# EAGLE design PIC18F26J50 (EAGLE 6.5.0)
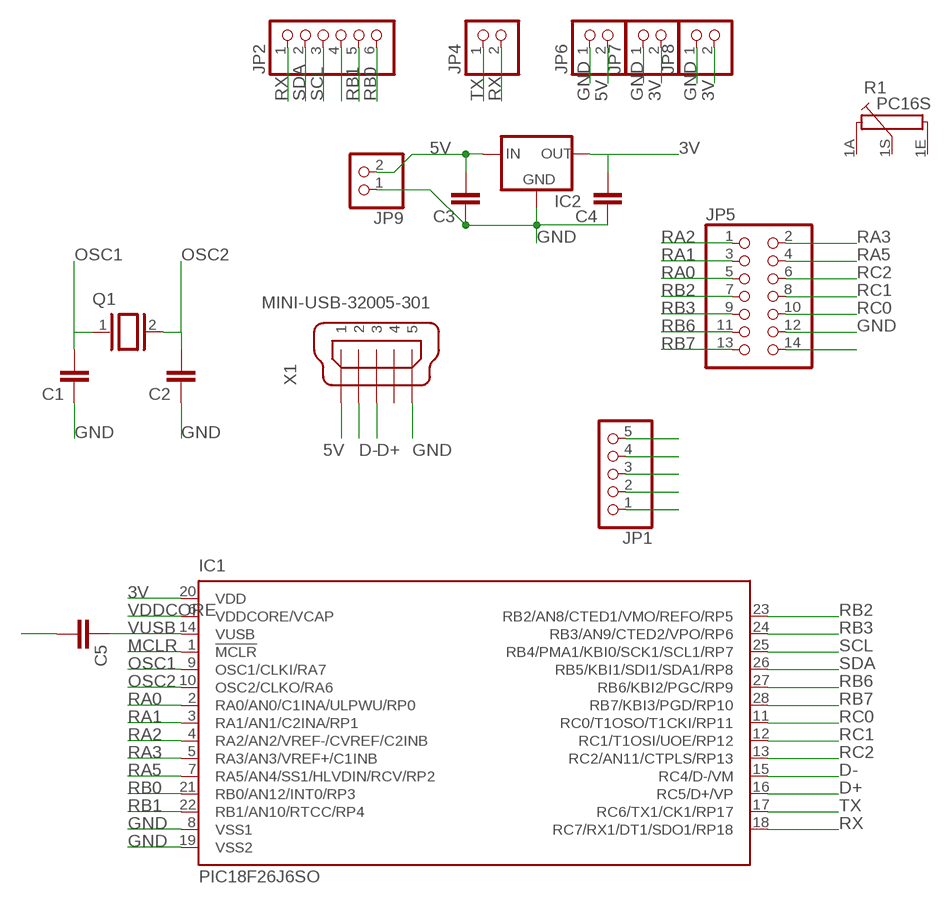
[diagram p0: schematic, sheet 1]

## Parts
C1  C-EU025-025X050  [C025-025X050]
C2  C-EU025-025X050  [C025-025X050]
C3  C-EU025-025X050  [C025-025X050]
C4  C-EU025-025X050  [C025-025X050]
C5  C-EU025-025X050  [C025-025X050]
IC1  PIC18F26J6SO  [SO28W]
IC2  78LXX-SOT89  [SOT89]
JP1  PINHD-1X5  [1X05]
JP2  PINHD-1X6  [1X06]
JP4  PINHD-1X2  [1X02]
JP5  PINHD-2X7  [2X07]
JP6  PINHD-1X2  [1X02]
JP7  PINHD-1X2  [1X02]
JP8  PINHD-1X2  [1X02]
JP9  PINHD-1X2  [1X02]
Q1  XTAL/S  [QS]
R1  PC16S  [PC16S]
X1  MINI-USB-32005-301  [32005-301]

## Nets
3V: C4.2 IC1.20(VDD) IC2.1(OUT) JP1.4 JP7.2 JP8.2
5V: C3.2 IC2.3(IN) JP6.2 JP9.2 X1.1
D+: IC1.16(RC5/D+/VP) X1.3
D-: IC1.15(RC4/D-/VM) X1.2
GND: C1.1 C2.1 C3.1 C4.1 C5.2 IC1.8(VSS1) IC1.19(VSS2) IC2.2(GND) JP1.5 JP5.12 JP5.14 JP6.1 JP7.1 JP8.1 JP9.1 X1.5
MCLR: IC1.1(!MCLR) JP1.1
OSC1: C1.2 IC1.9(OSC1/CLKI/RA7) Q1.1
OSC2: C2.2 IC1.10(OSC2/CLKO/RA6) Q1.2
RA0: IC1.2(RA0/AN0/C1INA/ULPWU/RP0) JP5.5
RA1: IC1.3(RA1/AN1/C2INA/RP1) JP5.3
RA2: IC1.4(RA2/AN2/VREF-/CVREF/C2INB) JP5.1
RA3: IC1.5(RA3/AN3/VREF+/C1INB) JP5.2
RA5: IC1.7(RA5/AN4/SS1/HLVDIN/RCV/RP2) JP5.4
RB0: IC1.21(RB0/AN12/INT0/RP3) JP2.6
RB1: IC1.22(RB1/AN10/RTCC/RP4) JP2.5
RB2: IC1.23(RB2/AN8/CTED1/VMO/REFO/RP5) JP2.4 JP5.7
RB3: IC1.24(RB3/AN9/CTED2/VPO/RP6) JP5.9
RB6: IC1.27(RB6/KBI2/PGC/RP9) JP1.2 JP5.11
RB7: IC1.28(RB7/KBI3/PGD/RP10) JP1.3 JP5.13
RC0: IC1.11(RC0/T1OSO/T1CKI/RP11) JP5.10
RC1: IC1.12(RC1/T1OSI/UOE/RP12) JP5.8
RC2: IC1.13(RC2/AN11/CTPLS/RP13) JP5.6
RX: IC1.18(RC7/RX1/DT1/SDO1/RP18) JP2.1 JP4.2
SCL: IC1.25(RB4/PMA1/KBI0/SCK1/SCL1/RP7) JP2.3
SDA: IC1.26(RB5/KBI1/SDI1/SDA1/RP8) JP2.2
TX: IC1.17(RC6/TX1/CK1/RP17) JP4.1
VDDCORE: IC1.6(VDDCORE/VCAP)
VUSB: C5.1 IC1.14(VUSB)
Unconnected: R1.1A R1.1E R1.1S X1.4

## Library data of the parts
C1-C5 = rcl 2:C-EU: CAPACITOR, European symbol
IC1 = microchip-dspic:PIC18F26J*: PIC18F47J53 Family High-Performance USB Microcontrollers with nanoWatt XLP Technology Source: Data sheet <http://ww1.microchip.com/downloads/en/DeviceDoc/39964B.pdf>; MPN: PIC18F26J53-I/SO; OC_FARNELL: unknown; OC_NEWARK: 63R7830
IC2 = v-reg-3:78LXX: VOLTAGE REGULATOR
JP1 = pinhead 2:PINHD-1X5: PIN HEADER
JP2 = pinhead 2:PINHD-1X6: PIN HEADER
JP4 JP6-JP9 = pinhead 2:PINHD-1X2: PIN HEADER
JP5 = pinhead 2:PINHD-2X7: PIN HEADER
Q1 = special 2:XTAL/S: CRYSTAL
R1 = piher 2:PC16S: POTENTIOMETER single carbon potentiometer, 16 mm, S3ROH
X1 = con-cypressindustries 2:MINI-USB-: MINI USB-B Conector Source: www.cypressindustries.com

## Board
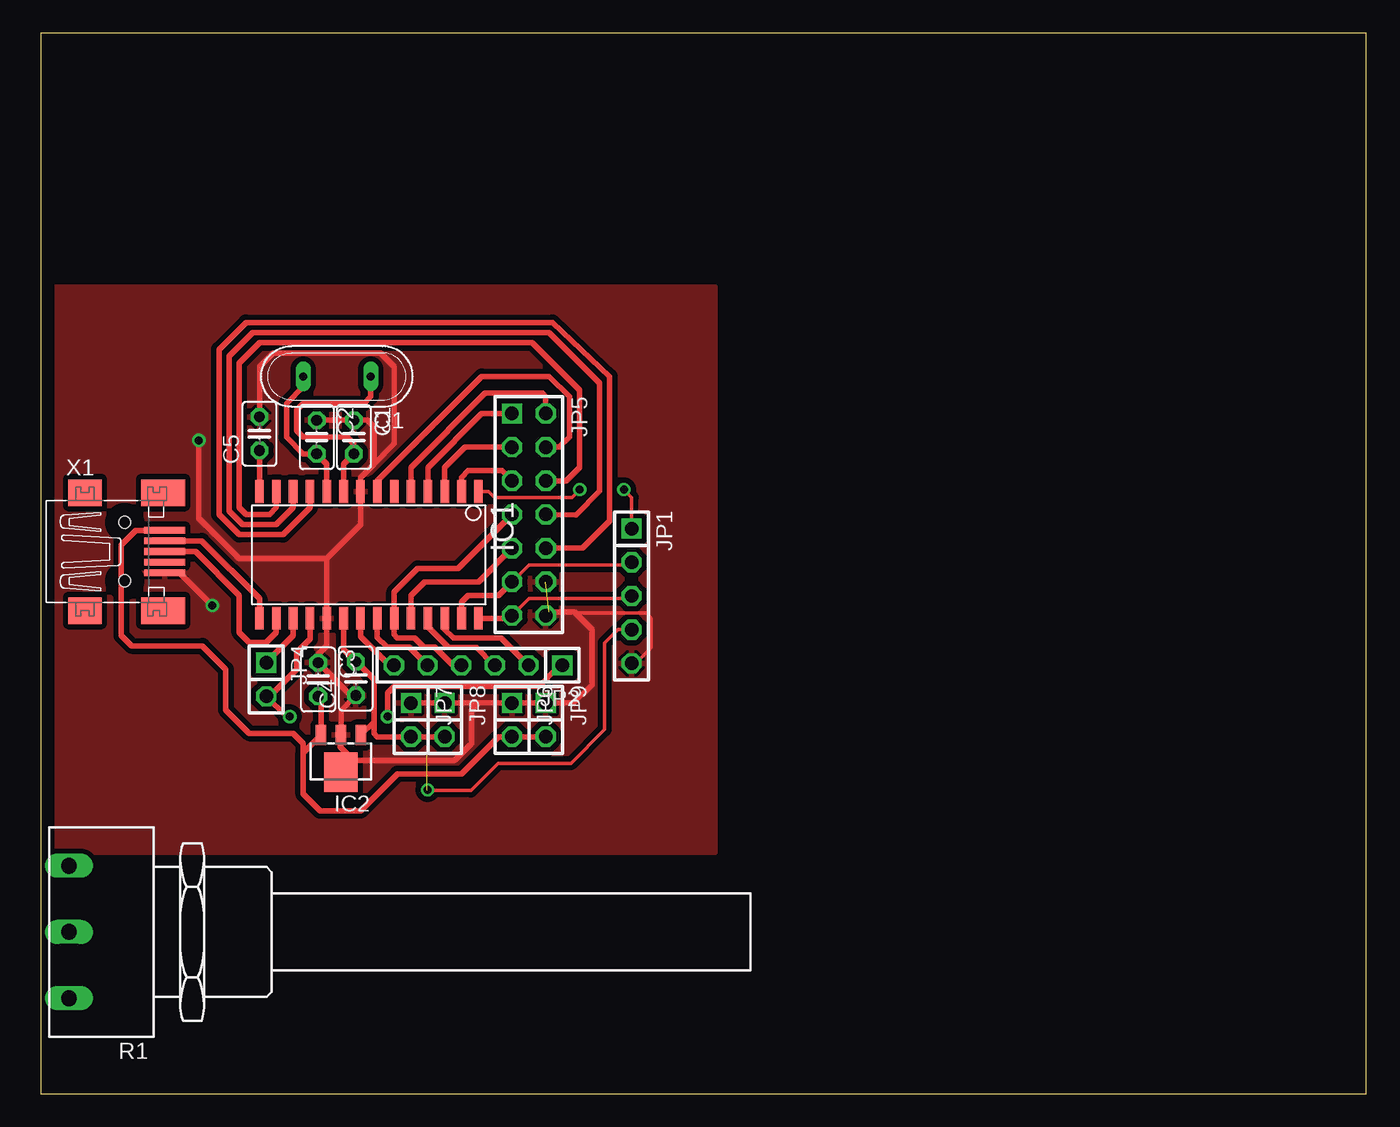
[diagram p1: board, top side]
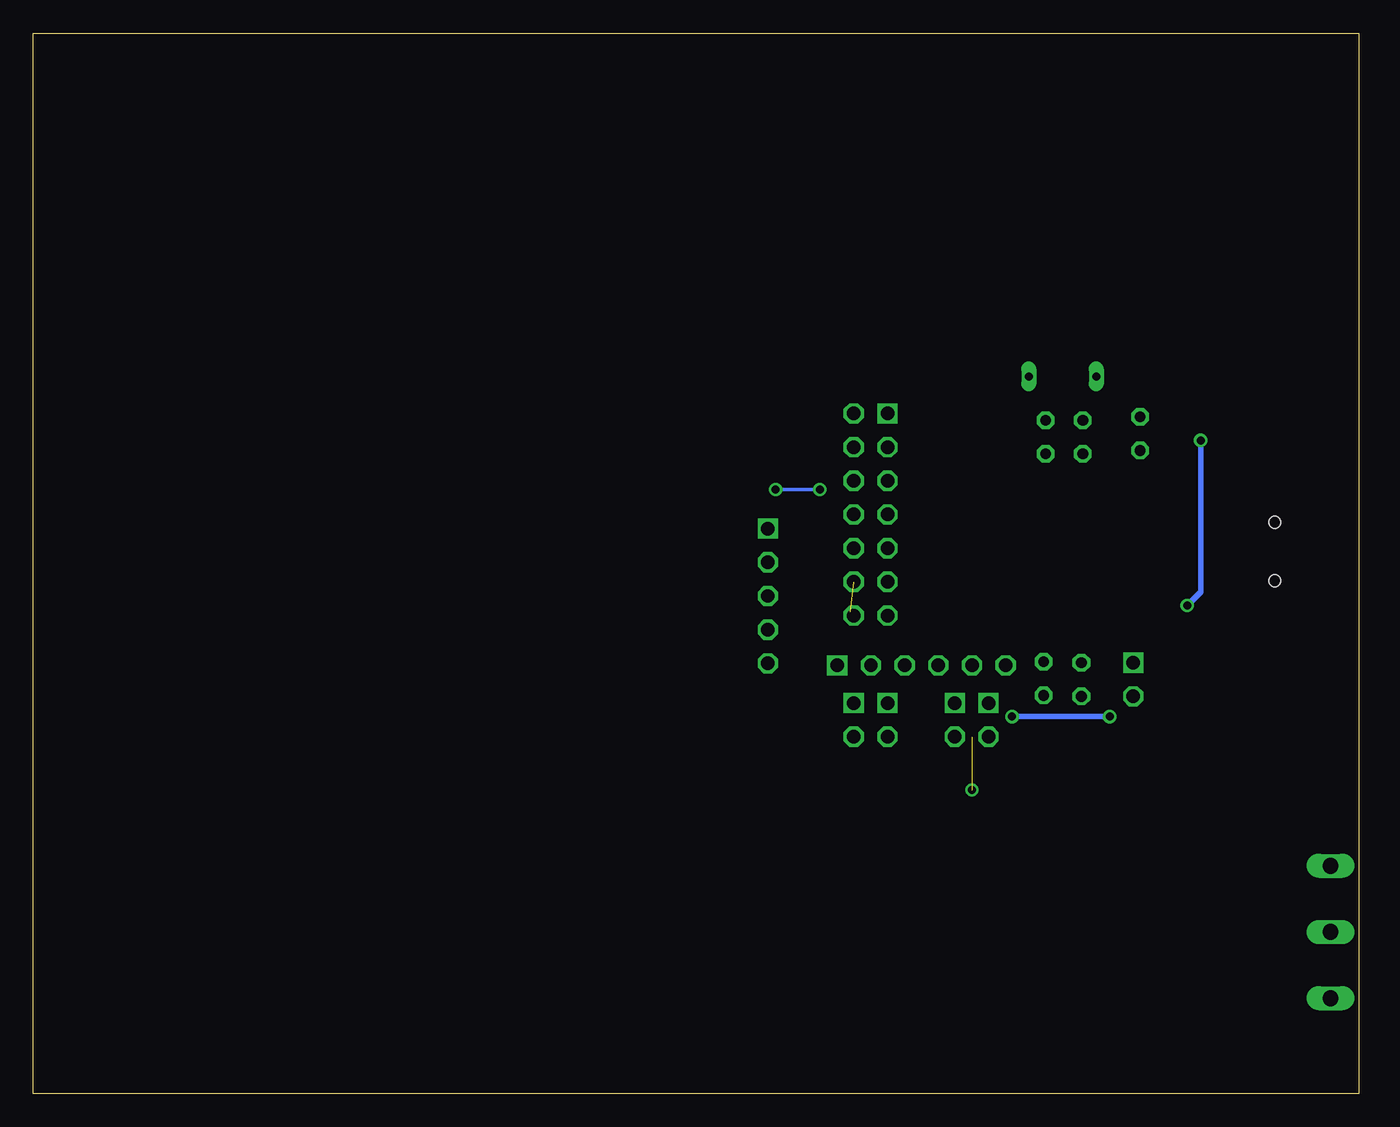
[diagram p2: board, bottom side, seen from below]

Size 100 x 80 mm. Coordinates in mm from the lower left corner, seen from the top.
Outline: 0,0 100,0 100,80 0,80 0,0
Copper layers (1*16): Top 0.035mm / dielectric 1.5mm / Bottom 0.035mm
Design rules "default": minimum track width 10mil, minimum drill 24mil, track to track 8mil, track to pad 8mil, pad to pad 8mil, via to via 8mil, smd to smd 8mil, copper to edge 40mil, drill to drill 8mil, minimum pad ring 10mil, minimum via ring 8mil, stop-mask expansion 4mil, vias tented up to drill 0mil, thermal gap 10mil

### Footprints (pad centres in the part's own frame; a part is rotated, then mirrored left to right if it is on the bottom)
C025-025X050 = drill 0.813 octagon: 1 -1.27,0; 2 1.27,0
SO28W = smd 0.65 x 1.7: 1 -7.62,-4.78; 2 -6.35,-4.78; 3 -5.08,-4.78; 4 -3.81,-4.78; 5 -2.54,-4.78; 6 -1.27,-4.78; 7 0,-4.78; 8 1.27,-4.78; 9 2.54,-4.78; 10 3.81,-4.78; 11 5.08,-4.78; 12 6.35,-4.78; 13 7.62,-4.78; 14 8.89,-4.78; 15 8.89,4.78; 16 7.62,4.78; 17 6.35,4.78; 18 5.08,4.78; 19 3.81,4.78; 20 2.54,4.78; 21 1.27,4.78; 22 0,4.78; 23 -1.27,4.78; 24 -2.54,4.78; 25 -3.81,4.78; 26 -5.08,4.78; 27 -6.35,4.78; 28 -7.62,4.78
SOT89 = smd 0.8 x 1.5: 1 -1.5,-1.75; 2 0,-1.75; 3 1.5,-1.75 | smd 2.5 x 3: 4 0,1.05
1X05 = drill 1.016 square: 1 -5.08,0 | drill 1.016 octagon: 2 -2.54,0; 3 0,0; 4 2.54,0; 5 5.08,0
1X06 = drill 1.016 square: 1 -6.35,0 | drill 1.016 octagon: 2 -3.81,0; 3 -1.27,0; 4 1.27,0; 5 3.81,0; 6 6.35,0
1X02 = drill 1.016 square: 1 -1.27,0 | drill 1.016 octagon: 2 1.27,0
2X07 = drill 1.016 square: 1 -7.62,-1.27 | drill 1.016 octagon: 2 -7.62,1.27; 3 -5.08,-1.27; 4 -5.08,1.27; 5 -2.54,-1.27; 6 -2.54,1.27; 7 0,-1.27; 8 0,1.27; 9 2.54,-1.27; 10 2.54,1.27; 11 5.08,-1.27; 12 5.08,1.27; 13 7.62,-1.27; 14 7.62,1.27
QS = drill 0.61 long: 1 -2.54,0; 2 2.54,0
PC16S = drill 1.2 long: 1A -5,6.5; 1E 5,6.5; 1S 0,6.5
32005-301 = smd 3.1 x 0.5: 1 3,1.6; 2 3,0.8; 3 3,0; 4 3,-0.8; 5 3,-1.6 | smd 2.5 x 2: M1 -3,-4.45; M2 -3,4.45 | smd 3.3 x 2: M3 2.9,4.45; M4 2.9,-4.45 | hole 0.9: 0,2.2; 0,-2.2

### Placement (x,y rotation side)
C1  23.62,49.53 270 top
C2  20.83,49.53 270 top
C3  20.93,31.24 270 top
C4  23.78,31.32 90 top
C5  16.51,49.78 90 top
IC1  25.4,40.64 180 top
IC2  22.65,25.31 180 top
JP1  44.58,37.54 270 top
JP2  32.99,32.31 180 top
JP4  17.02,31.24 270 top
JP5  36.83,43.69 270 top
JP6  35.56,28.19 270 top
JP7  27.94,28.19 270 top
JP8  30.48,28.19 270 top
JP9  38.1,28.19 270 top
Q1  22.35,54.1 180 top
R1  8.64,12.19 90 top
X1  6.35,40.89 0 top

### Tracks (layer width: path | path; a pad name or v marks a point on that pad's centre or on a via)
3V  (1 unrouted)
  Top 0.254: JP1.4 43.54,35 42.55,34.01 42.55,27.46 40.01,24.92 34.52,24.92 32.46,22.86 29.16,22.86
  Top 0.406: IC1.20 22.86,33.5 C4.2 23.8,32.59 25.15,31.24 25.15,28.05 | 25.15,28.05 IC2.1 | JP8.2 JP7.2 25.4,26.92 25.15,27.18 25.15,28.05
5V
  Top 0.406: JP9.2 JP6.2 34.54,26.92 31.75,24.13 26.92,24.13 24.13,21.34 21.08,21.34 19.81,22.61 19.81,25.65 19.81,25.72 | C3.2 21.15,29.76 IC2.3 19.81,25.72 | X1.1 7.19,42.49 6.1,41.4 6.1,34.54 6.86,33.78 12.19,33.78 13.97,32 13.97,28.96 15.75,27.18 19.05,27.18 19.81,26.42 19.81,25.72
D+
  Top 0.406: IC1.16 17.78,34.8 17.02,34.04 15.75,34.04 14.99,34.8 14.99,37.59 11.68,40.89 X1.3
D-
  Top 0.406: X1.2 12.15,41.69 16.51,37.34 IC1.15
GND  (via drill 0.6)  (1 unrouted)
  Top 0.254: JP1.5 44.88,32.46 46.05,33.63 46.05,35.89 45.67,36.27 40.01,36.27 39.95,36.32
  Top 0.406: 25.15,47.5 24.13,46.48 IC1.8 24.13,42.93 21.59,40.39 | 25.15,47.5 25.15,50.29 24.64,50.8 C1.1 C2.1 | C5.2 16.51,54.86 17.53,55.88 25.65,55.88 26.67,54.86 26.67,49.02 25.15,47.5 | 21.59,40.39 IC1.19 21.59,33.78 20.93,33.12 C3.1 23.4,30.05 C4.1 22.65,28.92 IC2.2 22.61,27.01 22.61,26.16 23.62,25.15 31.24,25.15 32.51,26.42 32.51,28.96 33.02,29.46 | 33.02,29.46 JP6.1 JP9.1 40.21,29.46 41.58,30.84 41.58,35.03 40.28,36.32 39.95,36.32 38.35,36.32 JP5.14 | 33.02,29.46 JP8.1 JP7.1 | X1.5 10.49,39.29 v12.95,36.83 | v11.94,49.28 11.94,43.43 14.99,40.39 21.59,40.39
  Bottom 0.406: v12.95,36.83 11.94,37.85 v11.94,49.28
  pour Top (isolate 0.406): 0,60.83 50.85,60.83 50.85,18.19 0,18.19
MCLR  (via drill 0.6)
  Top 0.254: IC1.1 33.8,45.42 34.24,44.98 40.08,44.98 v40.66,45.57 | JP1.1 44.58,44.98 v43.99,45.57
  Bottom 0.254: v43.99,45.57 v40.66,45.57
N$1  (via drill 0.6)
  other vias: 29.18,22.91
OSC1
  Top 0.406: IC1.9 22.86,47.5 C1.2 23.62,49.02 23.11,49.53 19.81,49.53 19.3,50.04 19.3,51.56 19.81,52.07 24.38,52.07 24.89,52.58 Q1.1
OSC2
  Top 0.406: IC1.10 21.59,47.5 C2.2 19.81,48.26 18.54,49.53 18.54,52.07 19.81,53.34 Q1.2
RA0
  Top 0.406: IC1.2 31.75,46.48 32.26,46.99 34.8,46.99 JP5.5
RA1
  Top 0.406: IC1.3 30.48,47.24 32,48.77 JP5.3
RA2
  Top 0.406: IC1.4 29.21,47.24 33.27,51.31 JP5.1
RA3
  Top 0.406: IC1.5 27.94,47.24 33.53,52.83 37.85,52.83 38.1,52.58 JP5.2
RA5
  Top 0.406: IC1.7 25.4,46.23 33.27,54.1 38.35,54.1 39.88,52.58 39.88,49.53 39.12,48.77 JP5.4
RB0
  Top 0.406: IC1.21 24.13,34.49 26.01,32.61 26.34,32.61 JP2.6
RB1
  Top 0.406: IC1.22 25.4,34.42 26.14,33.68 27.81,33.68 JP2.5
RB2
  Top 0.406: JP5.7 31.5,39.62 28.45,39.62 26.67,37.85 IC1.23 26.67,34.62 26.9,34.39 28.22,34.39 28.91,33.71 29.72,33.71 31.17,32.26 31.67,32.26 JP2.4
RB3
  Top 0.406: IC1.24 27.94,37.59 28.96,38.61 33.02,38.61 JP5.9
RB6
  Top 0.254: JP5.11 36.83,39.88 44.37,39.88 JP1.2
  Top 0.406: IC1.27 31.75,37.08 32.26,37.59 34.54,37.59 JP5.11
RB7
  Top 0.254: JP5.13 36.83,37.34 44.35,37.34 JP1.3
  Top 0.406: IC1.28 35.35,35.86 JP5.13
RC0
  Top 0.406: IC1.11 20.32,44.2 18.29,42.16 14.99,42.16 13.46,43.69 13.46,56.13 15.49,58.17 38.61,58.17 42.93,54.1 42.93,43.18 40.89,41.15 JP5.10
RC1
  Top 0.406: IC1.12 19.05,44.2 17.78,42.93 15.24,42.93 14.22,43.94 14.22,55.63 16,57.4 38.35,57.4 42.16,53.59 42.16,45.44 40.39,43.66 JP5.8
RC2
  Top 0.406: 17.78,45.47 IC1.13 17.78,44.2 17.27,43.69 15.49,43.69 14.99,44.2 14.99,55.12 16.51,56.64 37.08,56.64 40.64,53.09 40.64,47.24 39.62,46.23 JP5.6
RX  (via drill 0.6)
  Top 0.406: IC1.18 20.32,34.29 19.3,33.27 19.3,32 17.27,29.97 JP4.2 18.54,28.45 v18.8,28.45 | v26.16,28.45 26.16,30.23 26.67,30.73 37.59,30.73 38.89,32.03 39.06,32.03 JP2.1
  Bottom 0.406: v26.16,28.45 v18.8,28.45
SCL
  Top 0.406: JP2.3 34.19,32.38 34.14,32.38 32.87,33.66 30.76,33.66 29.21,35.2 IC1.25
SDA
  Top 0.406: JP2.2 34.75,34.37 31.14,34.37 30.48,35.03 IC1.26
TX
  Top 0.406: JP4.1 19.05,34.54 IC1.17
VUSB
  Top 0.406: IC1.14 C5.1